# Altium schematic sheet IR2110.SchDoc
size A3; SheetNumber: 1; SheetTotal: 3
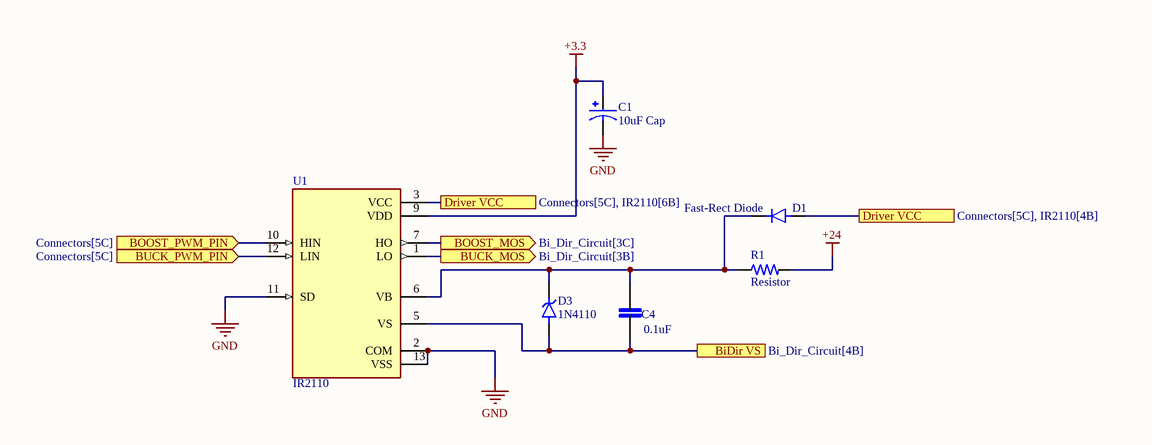
[diagram p0: IR2110.SchDoc]

## Parts
C1  10uF Cap  [CAP_10uF]
C4  0.1uF  [Ceramic Capacitor]
D1  Fast-Rect Diode  [Common Trhough Hole]
D3  1N4110  [Common Trhough Hole]
R1  Resistor  [Resistor_Through Hole]
U1  IR2110  [IR2110]

## Ports
BiDir VS (see Bi_Dir_Circuit[4B]), BOOST_MOS (out, see Bi_Dir_Circuit[3C]), BOOST_PWM_PIN (in, see Connectors[5C]), BUCK_MOS (out, see Bi_Dir_Circuit[3B]), BUCK_PWM_PIN (in, see Connectors[5C]), Driver VCC (see Connectors[5C], IR2110[4B]), Driver VCC (see Connectors[5C], IR2110[6B])

## Nets
+3.3: C1.P U1.9(VDD)
+24: R1.2
GND: C1.N U1.2(COM) U1.11(SD) U1.13(VSS)
BiDir VS: C4.1 D3.2(A) U1.5(VS) ; port BiDir VS
BOOST_MOS: U1.7(HO) ; port BOOST_MOS
BOOST_PWM_PIN: U1.10(HIN) ; port BOOST_PWM_PIN
BUCK_MOS: U1.1(LO) ; port BUCK_MOS
BUCK_PWM_PIN: U1.12(LIN) ; port BUCK_PWM_PIN
Driver VCC: D1.2(A) U1.3(VCC) ; port Driver VCC
NetC4_2: C4.2 D1.1(K) D3.1(K) R1.1 U1.6(VB)

## Library data of the parts
C1 = 10uF Cap: CAP ALUM 10UF 20% 50V RADIAL; MP: ECE-A1HN100UI; MF: Panasonic; SnapEDA_Link: https://www.snapeda.com/parts/ECE-A1HN100UI/Panasonic/view-part/2321690/?ref=snap; Price: None; Check_prices: https://www.snapeda.com/parts/ECE-A1HN100UI/Panasonic/view-part/2321690/?ref=eda; Value: *; Availability: In Stock; Package: RADIAL-2 Panasonic
C4 = Ceramic Capacitor: MP: LD051A121KAB2A; MF: AVX; SnapEDA_Link: https://www.snapeda.com/parts/LD051A121KAB2A/AVX/view-part/?ref=snap; Package: 0805 AVX; Check_prices: https://www.snapeda.com/parts/LD051A121KAB2A/AVX/view-part/?ref=eda; Purchase-URL: https://pricing.snapeda.com/search/part/LD051A121KAB2A/?ref=eda; Price: None; Value: *; Availability: In Stock
D1 = Normal Diode: MF: NTE Electronics, Inc.; MP: 1N4007; Package: DO-41 NTE Electronics; Check_prices: https://www.snapeda.com/parts/1N4007/NTE+Electronics/view-part/?ref=eda; Value: *; Purchase-URL: https://pricing.snapeda.com/search/part/1N4007/?ref=eda; Availability: In Stock; SnapEDA_Link: https://www.snapeda.com/parts/1N4007/NTE+Electronics/view-part/?ref=snap; Price: None
D3 = Zener Diode: MP: 1SMA5926; MF: Taiwan Semiconductor; Package: SMA-2 Taiwan Semiconductor; Availability: In Stock; Purchase-URL: https://pricing.snapeda.com/search/part/1SMA5926/?ref=eda; SnapEDA_Link: https://www.snapeda.com/parts/1SMA5926/Taiwan+Semiconductor/view-part/?ref=snap; Price: None; Check_prices: https://www.snapeda.com/parts/1SMA5926/Taiwan+Semiconductor/view-part/?ref=eda; Value: *
R1 = Resistor: Power_Rating: .25 W; MP: 2-2176053-0; Tolerance: 1%; Resistance: .33; MF: TE Connectivity; Price: None; Availability: In Stock; EU_RoHS_Compliance: Compliant with Exemptions; Package: 0805; Value: *; SnapEDA_Link: https://www.snapeda.com/parts/2-2176053-0/TE+Connectivity/view-part/?ref=snap; Check_prices: https://www.snapeda.com/parts/2-2176053-0/TE+Connectivity/view-part/?ref=eda
U1 = IR2110: Half-Bridge Gate Driver IC Non-Inverting 16-SOIC; MF: Infineon; Package: SOIC-16 International Rectifier; Purchase-URL: https://pricing.snapeda.com/search/part/IR2110/?ref=eda; Value: *; SnapEDA_Link: https://www.snapeda.com/parts/IR2110/Infineon+Technologies/view-part/?ref=snap; Price: None; MP: IR2110; Check_prices: https://www.snapeda.com/parts/IR2110/Infineon+Technologies/view-part/?ref=eda; Availability: In Stock